# Altium schematic sheet FallDetection.SchDoc: 跌倒检测
size A4
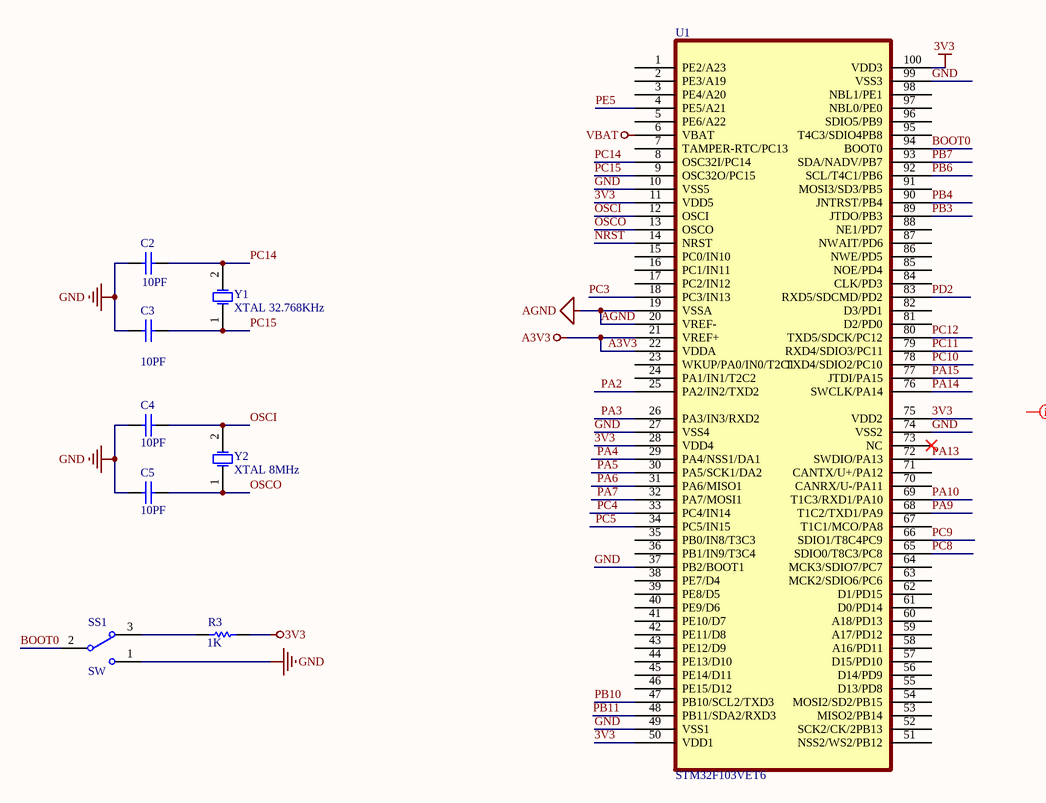
[diagram p0: FallDetection.SchDoc]

## Parts
C2  10PF  [1608[0603]]
C3  10PF  [1608[0603]]
C4  10PF  [1608[0603]]
C5  10PF  [1608[0603]]
R3  value 1K  [J1-0603]  (hidden comment: Res1)
SS1  SW  [SS-12F44]
U1  STM32F103VET6  [TQFP100-2]
Y1  XTAL 32.768KHz  [XTAL2]
Y2  XTAL 8MHz  [XTAL1]

## Nets
3V3: R3.2 U1.11(VDD5) U1.28(VDD4) U1.50(VDD1) U1.75(VDD2) U1.100(VDD3)
A3V3: U1.21(VREF+) U1.22(VDDA)
AGND: U1.19(VSSA) U1.20(VREF-)
GND: C2.2 C3.2 C4.2 C5.2 SS1.1 U1.10(VSS5) U1.27(VSS4) U1.37(PB2/BOOT1) U1.49(VSS1) U1.74(VSS2) U1.99(VSS3)
VBAT: U1.6(VBAT)
BOOT0: SS1.2 U1.94(BOOT0)
NRST: U1.14(NRST)
OSCI: C4.1 U1.12(OSCI) Y2.2(OSC2)
OSCO: C5.1 U1.13(OSCO) Y2.1(OSC1)
PA2: U1.25(PA2/IN2/TXD2)
PA3: U1.26(PA3/IN3/RXD2)
PA4: U1.29(PA4/NSS1/DA1)
PA5: U1.30(PA5/SCK1/DA2)
PA6: U1.31(PA6/MISO1)
PA7: U1.32(PA7/MOSI1)
PA9: U1.68(T1C2/TXD1/PA9)
PA10: U1.69(T1C3/RXD1/PA10)
PA13: U1.72(SWDIO/PA13)
PA14: U1.76(SWCLK/PA14)
PA15: U1.77(JTDI/PA15)
PB3: U1.89(JTDO/PB3)
PB4: U1.90(JNTRST/PB4)
PB6: U1.92(SCL/T4C1/PB6)
PB7: U1.93(SDA/NADV/PB7)
PB10: U1.47(PB10/SCL2/TXD3)
PB11: U1.48(PB11/SDA2/RXD3)
PC3: U1.18(PC3/IN13)
PC4: U1.33(PC4/IN14)
PC5: U1.34(PC5/IN15)
PC8: U1.65(SDIO0/T8C3/PC8)
PC9: U1.66(SDIO1/T8C4PC9)
PC10: U1.78(TXD4/SDIO2/PC10)
PC11: U1.79(RXD4/SDIO3/PC11)
PC12: U1.80(TXD5/SDCK/PC12)
PC14: C2.1 U1.8(OSC32I/PC14) Y1.2(OSC2)
PC15: C3.1 U1.9(OSC32O/PC15) Y1.1(OSC1)
PD2: U1.83(RXD5/SDCMD/PD2)
PE5: U1.4(PE5/A21)
NetR3_1: R3.1 SS1.3

Not connected (* = marked no-connect by the designer): U1 1(PE2/A23) 2(PE3/A19) 3(PE4/A20) 5(PE6/A22) 7(TAMPER-RTC/PC13) 15(PC0/IN10) 16(PC1/IN11) 17(PC2/IN12) 23(WKUP/PA0/IN0/T2C1) 24(PA1/IN1/T2C2) 35(PB0/IN8/T3C3) 36(PB1/IN9/T3C4) 38(PE7/D4) 39(PE8/D5) 40(PE9/D6) 41(PE10/D7) 42(PE11/D8) 43(PE12/D9) 44(PE13/D10) 45(PE14/D11) 46(PE15/D12) 51(NSS2/WS2/PB12) 52(SCK2/CK/2PB13) 53(MISO2/PB14) 54(MOSI2/SD2/PB15) 55(D13/PD8) 56(D14/PD9) 57(D15/PD10) 58(A16/PD11) 59(A17/PD12) 60(A18/PD13) 61(D0/PD14) 62(D1/PD15) 63(MCK2/SDIO6/PC6) 64(MCK3/SDIO7/PC7) 67(T1C1/MCO/PA8) 70(CANRX/U-/PA11) 71(CANTX/U+/PA12) 73(NC)* 81(D2/PD0) 82(D3/PD1) 84(CLK/PD3) 85(NOE/PD4) 86(NWE/PD5) 87(NWAIT/PD6) 88(NE1/PD7) 91(MOSI3/SD3/PB5) 95(T4C3/SDIO4PB8) 96(SDIO5/PB9) 97(NBL0/PE0) 98(NBL1/PE1)

## Layout directives
net class CPU: (no net found under the mark)

## Notes on the sheet
- Title
- Size:
- Date:
- A4
- Number:
- Time:
- Revision:
- Sheet
- of
- File:

## Library data of the parts
C2 C3 = Cap: Capacitor; Published: 8-Jun-2000; LatestRevisionDate: 17-Jul-2002; LatestRevisionNote: Re-released for DXP Platform.; PackageReference: RAD-0.3; Publisher: Altium Limited; Value: 10PF
C4 C5 = Cap: Capacitor; Value: 0.01uF; Published: 8-Jun-2000; LatestRevisionDate: 17-Jul-2002; LatestRevisionNote: Re-released for DXP Platform.; PackageReference: RAD-0.3; Publisher: Altium Limited
R3 = Res1: Resistor; Published: 8-Jun-2000; LatestRevisionDate: 17-Jul-2002; LatestRevisionNote: Re-released for DXP Platform.; PackageReference: AXIAL-0.3; Publisher: Altium Limited; PackageDescription: Axial Device, Thru-Hole; 2 Leads; 0.3 in Pin Spacing
SS1 = SS-12F44: 拨动开关 SS-12F44 二挡立式 1P2T SS12F44G5 滑动开关
U1 = STM32F103VET6: ST High-density performance line ARM-based 32-bit MCU with 256 to  512KB Flash, USB, CAN, 11 timers, 3 ADCs, 13 communication interfaces
Y1 Y2 = XTAL: Crystal Oscillator; Published: 8-Jun-2000; LatestRevisionDate: 17-Jul-2002; LatestRevisionNote: Re-released for DXP Platform.; PackageReference: R38; Publisher: Altium Limited